# Altium schematic sheet MCU.SchDoc
size A3; SheetNumber: 2; SheetTotal: 9
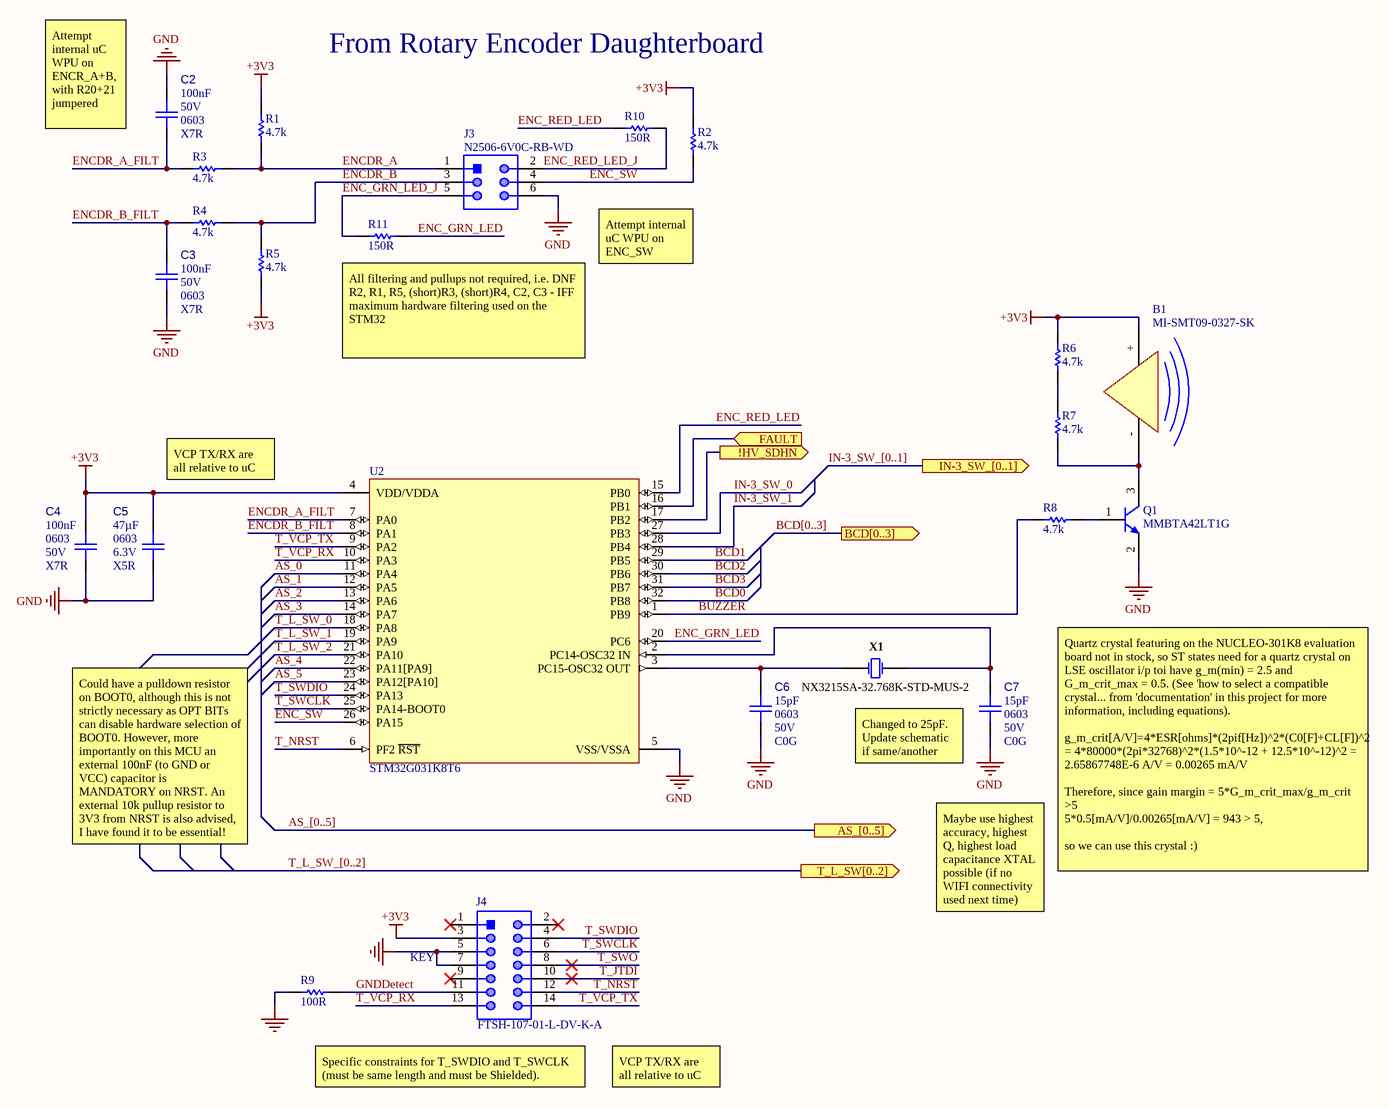
[diagram p0: MCU.SchDoc]

## Parts
?  (no value)
B1  MI-SMT09-0327-SK  [INDP9696X53N]
C2  value 100nF  Voltage Rating: 50V  Case/Package: 0603  Dielectric: X7R  [CAPC1608X09N]  (hidden comment: CGA3E2X7R1H104K080AA)
C3  value 100nF  Voltage Rating: 50V  Case/Package: 0603  Dielectric: X7R  [CAPC1608X09N]  (hidden comment: CGA3E2X7R1H104K080AA)
C4  value 100nF  Voltage Rating: 50V  Case/Package: 0603  Dielectric: X7R  [CAPC1608X09N]  (hidden comment: CGA3E2X7R1H104K080AA)
C5  value 47µF  Dielectric: X5R  Voltage Rating: 6.3V  Case/Package: 0603  [CAPC1608X87X35NL15T15]  (hidden comment: 06036D476MAT2A)
C6  value 15pF  Voltage Rating: 50V  Dielectric: C0G  Case/Package: 0603  [CAPC1608X87X35NL15T15]  (hidden comment: C0603X150J5GACTU)
C7  value 15pF  Voltage Rating: 50V  Dielectric: C0G  Case/Package: 0603  [CAPC1608X87X35NL15T15]  (hidden comment: C0603X150J5GACTU)
J3  N2506-6V0C-RB-WD  [N2506-6V0C-RB-WD-Footprint-1]
J4  FTSH-107-01-L-DV-K-A  [FP-FTSH-107-01-L-DV-K-A-MFG]
Q1  MMBTA42LT1G  [ONSC-SOT-23-3-318-08_V]
R1  value 4.7k  [RESC1608X55X25NL10T15]  (hidden comment: Resistor 4k7 +/-1% 0603 100 mW)
R2  value 4.7k  [RESC1608X55X25NL10T15]  (hidden comment: Resistor 4k7 +/-1% 0603 100 mW)
R3  value 4.7k  [RESC1608X55X25NL10T15]  (hidden comment: Resistor 4k7 +/-1% 0603 100 mW)
R4  value 4.7k  [RESC1608X55X25NL10T15]  (hidden comment: Resistor 4k7 +/-1% 0603 100 mW)
R5  value 4.7k  [RESC1608X55X25NL10T15]  (hidden comment: Resistor 4k7 +/-1% 0603 100 mW)
R6  value 4.7k  [RESC1608X55X25NL10T15]  (hidden comment: Resistor 4k7 +/-1% 0603 100 mW)
R7  value 4.7k  [RESC1608X55X25NL10T15]  (hidden comment: Resistor 4k7 +/-1% 0603 100 mW)
R8  value 4.7k  [RESC1608X55X25NL10T15]  (hidden comment: Resistor 4k7 +/-1% 0603 100 mW)
R9  value 100R  [RESC1608X55X25NL10T15]  (hidden comment: ERJ-3EKF1000V)
R10  value 150R  [RESC1608X55X25NL10T15]  (hidden comment: CRCW0603150RFKEAHP)
R11  value 150R  [RESC1608X55X25NL10T15]  (hidden comment: CRCW0603150RFKEAHP)
U2  STM32G031K8T6  [TQFP80P900X900X160-32N]
X1  NX3215SA-32.768K-STD-MUS-2  [NX3215SA-32.768K-STD-MUS-2-Footprint-1]

## Ports
!HV_SDHN (out), AS_[0..5] (out), BCD[0..3] (out), FAULT (in), IN-3_SW_[0..1] (out), T_L_SW[0..2] (out)

## Nets
+3V3: B1.+(VCC) C4.1 C5.1 J4.3 R1.2 R2.2 R5.1 R6.2 U2.4(VDD/VDDA)
GND: C2.2 C3.1 C4.2 C5.2 C6.2 C7.2 J3.6 J4.5 J4.7 Q1.2(E) R9.1 U2.5(VSS/VSSA)
!HV_SDHN: U2.17(PB2) ; port !HV_SDHN
AS_0: U2.11(PA4)
AS_1: U2.12(PA5)
AS_2: U2.13(PA6)
AS_3: U2.14(PA7)
AS_4: U2.22(PA11[PA9])
AS_5: U2.23(PA12[PA10])
BCD0: U2.32(PB8)
BCD1: U2.29(PB5)
BCD2: U2.30(PB6)
BCD3: U2.31(PB7)
BUZZER: R8.1 U2.1(PB9)
ENC_GRN_LED: R11.2 U2.20(PC6)
ENC_GRN_LED_J: J3.5 R11.1
ENC_RED_LED: R10.2 U2.15(PB0)
ENC_RED_LED_J: J3.2 R10.1
ENC_SW: J3.4 R2.1 U2.26(PA15)
ENCDR_A: J3.1 R1.1 R3.2
ENCDR_A_FILT: C2.1 R3.1 U2.7(PA0)
ENCDR_B: J3.3 R4.2 R5.2
ENCDR_B_FILT: C3.2 R4.1 U2.8(PA1)
FAULT: U2.16(PB1) ; port FAULT
GNDDetect: J4.11 R9.2
IN-3_SW_0: U2.27(PB3)
IN-3_SW_1: U2.28(PB4)
T_JTDI: J4.10
T_L_SW_0: U2.18(PA8)
T_L_SW_1: U2.19(PA9)
T_L_SW_2: U2.21(PA10)
T_NRST: J4.12 U2.6(PF2_~{RST})
T_SWCLK: J4.6 U2.25(PA14-BOOT0)
T_SWDIO: J4.4 U2.24(PA13)
T_SWO: J4.8
T_VCP_RX: J4.13 U2.10(PA3)
T_VCP_TX: J4.14 U2.9(PA2)
NetB1_-: B1.-(GND) Q1.3(C) R7.1
NetC6_1: C6.1 U2.3(PC15-OSC32_OUT) X1.1
NetC7_1: C7.1 U2.2(PC14-OSC32_IN) X1.2
NetQ1_1: Q1.1(B) R8.2
NetR6_1: R6.1 R7.2

Not connected (* = marked no-connect by the designer): J4 1* 2* 9*

## Buses and harness runs
bus AS_[0..5] = port AS_[0..5]
bus BCD[0..3] = port BCD[0..3]
bus IN-3_SW_[0..1] = port IN-3_SW_[0..1]
bus T_L_SW_[0..2] = port T_L_SW[0..2]

## Notes on the sheet
- From Rotary Encoder Daughterboard
- (near C2) Attempt internal uC WPU on ENCR_A+B, with R20+21 jumpered
- Attempt internal uC WPU on ENC_SW
- (near R11) All filtering and pullups not required, i.e. DNF R2, R1, R5, (short)R3, (short)R4, C2, C3 - IFF maximum hardware filtering used on the STM32
- VCP TX/RX are all relative to uC
- Changed to 25pF. Update schematic if same/another 12.5pF load capacitance XTAL is used
- Could have a pulldown resistor on BOOT0, although this is not strictly necessary as OPT BITs can disable hardware selection of BOOT0. However, more importantly on this MCU an external 100nF (to GND or VCC) capacitor is MANDATORY on NRST. An external 10k pullup resistor to 3V3 from NRST is also advised, I have found it to be essential!
- Maybe use highest accuracy, highest Q, highest load capacitance XTAL possible (if no WIFI connectivity used next time)
- Quartz crystal featuring on the NUCLEO-301K8 evaluation board not in stock, so ST states need for a quartz crystal on LSE oscillator i/p toi have g_m(min) = 2.5 and G_m_crit_max = 0.5. (See 'how to select a compatible crystal... from 'documentation' in this project for more information, including equations).
  g_m_crit[A/V]=4*ESR[ohms]*(2pif[Hz])^2*(C0[F]+CL[F])^2 = 4*80000*(2pi*32768)^2*(1.5*10^-12 + 12.5*10^-12)^2 = 2.65867748E-6 A/V = 0.00265 mA/V
  Therefore, since gain margin = 5*G_m_crit_max/g_m_crit >5
  5*0.5[mA/V]/0.00265[mA/V] = 943 > 5,
  so we can use this crystal :)
- (near J4) KEY
- Specific constraints for T_SWDIO and T_SWCLK (must be same length and must be Shielded).
- Project:
- Designer:
- Sheet
- of
- Filename:

## Library data of the parts
? = CMP-00003-4: The KETS Schematic Sheet Title Block
B1 = CMP-00030-00004-2: Magnetic Indicator SMT 9.6MM 3V; RoHS Compliant: Yes; Mounting Technology: SMT; Pins: 2
C2-C4 = CMP-001-00101-1: Ceramic Capacitor, Multilayer, Ceramic, 50V, 10% +Tol, 10% -Tol, X7R, 15% TC, 0.1uF, Surface Mount, 0603; Reference Standard: AEC-Q200; Multilayer: Yes; Tolerance  (fill in as +-): 10%; Mounting Technology: Surface Mount; Max Operating Temperature: 125°C; Min Operating Temperature: -55°C; Tolerance: 10%; Packaging: Tape and Reel; Length: 1.6mm; Package Style: SMTMeter; Width: 0.8mm; Height: 0.8mm; Pins: 2; Reach SVHC Compliant: Yes; RoHS Compliant: Yes; Package Shape: Rectangular; Tolerance (fill in as +-): 10%; Rated DC Voltage (URdc): 50V; JESD-609 Code: e3; Capacitor Type: Ceramic; Termination: Wraparound; Terminal Finish: Nickel; Dielectric Material: Ceramic; Temperature Characteristics Code: X7R
C5 = CMP-00388-1: 0603 (1608Metric) CERAMIC CAPACITOR ceramic capacitor 6.3V 47uF ±20% X5R; Capacitor Type: MLCC; Number of Terminals: 2; Mounting Technology: Surface Mount; Length: 1.6mm; Tolerance: 20%; Max Operating Temperature: 85°C; Lifecycle Status: Production; Min Operating Temperature: -55°C; Schedule B: 8532240020; Voltage Rating (DC): 6.3V; RoHS Compliant: Yes; Pins: 2; RoHS: Compliant; Height: 1.02mm; Dielectric Material: Ceramic; Width: 800µm; Material: Ceramic; REACH SVHC: Yes
C6 C7 = CMP-00385-1: Cap Ceramic 15pF 50V C0G 5% Pad SMD 0603 Flexible Termination 125C Extreme Low ESR T/R; RoHS Compliant: Yes; Termination: SMD/SMT; Case Code (Imperial): 0603; Features: Soft Termination; Schedule B: 8532240020, 8532240020; Tolerance: 5%; Voltage Rating (DC): 50V; Lifecycle Status: Production; Depth: 800µm; Length: 1.6mm; Height: 800µm; Packaging: Tape & Reel; Case Code (Metric): 1608; China RoHS: Compliant; Thickness: 863.6µm; Pins: 2; Max Operating Temperature: 125°C; Mounting Technology: Surface Mount; Lead Free: Lead Free; Dielectric Material: Ceramic; RoHS: Compliant; Min Operating Temperature: -55°C; Radiation Hardening: No; Number of Terminals: 2; Width: 800µm; REACH SVHC: Yes
J3 = CMP-002-00208-1: 80001386988 N2506-6V0C-Rb-Wd=06//Ht/Vsmt/30U/Rohs/Cap/T&r; Number of Positions: 6; Current Rating: 5A; Pitch: 2.54mm; Connector Type: Male Pin; Insulation Resistance: 1GΩ; Plating Thickness: 762nm; Row Spacing: 6.86mm; Color: Black; Pins: 6; Max Operating Temperature: 105°C; Terminal Pitch: 2.54mm; Number of Rows: 2; Contact Plating: Gold; Mounting Technology: Surface Mount; Min Operating Temperature: -55°C; REACH SVHC: Yes; Contact Mating Length: 6.1722mm; Height: 11.06mm; Contact Gender: Male; Termination: Solder; Contact Material: Gold, Tin; Lifecycle Status: Production; RoHS: Compliant; Number of Contacts: 6
J4 = CMP-002-00203-1: Conn Unshrouded Header HDR 14 POS 1.27mm Solder ST Top Entry SMD TIGER CLAW™ Tube; Manufacturer Lifecycle Status: PRODUCTION; Current Rating: 3.4A; Gender: Male; Number of Contacts: 14; Contact Plating: Gold; Pitch: 1.27mm; Termination: Solder; Orientation: Vertical; Lifecycle Status: Production; Number of Rows: 2; Max Operating Temperature: 125°C; Pins: 14; Height: 6.38mm; Schedule B: 8536694040; Contact Material: Gold, Nickel; Lead Free: Lead Free; Min Operating Temperature: -55°C; RoHS: Compliant
Q1 = CMP-013-00062-1: Bipolar (BJT) Single Transistor, General Purpose, NPN, 300 V, 500 mA, 225 mW, SOT-23, Surface Mount; Manufacturer Lifecycle Status: ACTIVE; Frequency: 50MHz; Max Collector Current: 500mA; Collector Emitter Breakdown Voltage: 300V; Emitter Base Voltage (VEBO): 6V; Collector Emitter Saturation Voltage: 500mV; Number of Elements: 1; Max Power Dissipation: 300mW; hFE Min: 40; Clock Frequency: 50MHz; Element Configuration: Single; Packaging: Tape and Reel; Lead Free: Lead Free; RoHS: Compliant; Number of Terminals: 3; Lifecycle Status: Production; Current Rating: 500mA; Polarity: NPN; Width: 1.397mm; Case/Package: SOT-23-3; Max Operating Temperature: 150°C; China RoHS: Compliant; Height: 1.016mm; Weight: 4.535924g; Gain Bandwidth Product: 50MHz; Contact Plating: Tin; Schedule B: 8541210080, 8541210080; Pins: 3; Transition Frequency: 50MHz; Voltage Rating (DC): 300V; REACH SVHC: Yes; Collector Emitter Voltage (VCEO): 300V; Min Operating Temperature: -55°C; Collector Base Voltage (VCBO): 300V; Length: 3.0226mm; Max Breakdown Voltage: 300V; Radiation Hardening: No
R1-R8 = CMP-009-00031-13: Chip Resistor, 4.7 KOhm, +/- 1%, 0.1 W, -55 to 155 degC, 0603 (1608 Metric); Power: 100mW; RoHS Compliant: True; Min Operating Temperature: -55°C; Tolerance: 1%; Mounting Technology: SM; Max Operating Temperature: 155°C; Pins: 2; Case/Package: 0603
R9 = CMP-00265-1: Fixed Resistor, Metal Glaze/thick Film, 0.1W, 100ohm, 75V, 1% +/-Tol, 100ppm/Cel, Surface Mount, 0603; Package Length: 1.6mm; Package Height: 0.45mm; Power: 100mW; Temperature Coefficient (ppm/Cel): 100; Package Width: 0.8mm; Reference Standard: AEC-Q200; Rated Temperature: 70°C; Mounting Technology: Surface Mount; Pins: 2; Packaging: Tape and Reel; Case/Package: 0603; Technology: METAL GLAZE/THICK FILM; Voltage Rating: 75V; RoHS Compliant: Yes; Construction: Rectangular; Max Operating Temperature: 155°C; JESD-609 Code: e3; Tolerance: 1%; Reach SVHC Compliant: Yes; Package Shape: Rectangular; Resistor Type: FIXED RESISTOR; Terminal Finish: Nickel; Termination: Wraparound; Working Voltage: 75V; Min Operating Temperature: -55°C
R10 R11 = CMP-00382-2: Res Thick Film 0603 150 Ohm 1% 1/3W ±100ppm/°C Molded SMD SMD Paper T/R; Voltage Rating: 75V; Power Rating: 330mW; Max Power Dissipation: 250mW; Power: 100mW; Case Code (Metric): 1608; Pins: 2; Lifecycle Status: Production; Radiation Hardening: No; Tolerance: 1%; Packaging: Cut Tape; RoHS: Compliant; Features: Automotive AEC-Q200; Case/Package: 0603; Number of Terminations: 2; Lead Free: Lead Free; RoHS Compliant: Yes; Depth: 850µm; Height: 450µm; Min Operating Temperature: -55°C; Max Operating Temperature: 155°C; Length: 1.55mm; China RoHS: Non-Compliant; Temperature Coefficient: 100ppm/°C; Schedule B: 8533210045, 8533210045; Composition: Thick Film; Working Voltage: 75V; Weight: 2.012816mg; Military Standard: Not; Mounting Technology: Surface Mount; Voltage Rating (DC): 75V; Number of Terminals: 2; Termination: SMD/SMT; Case Code (Imperial): 0603; Contact Plating: Tin; Width: 850µm; Power Dissipation: 330mW; REACH SVHC: Yes
U2 = CMP-00383-2: RISC Microcontroller, 32-Bit, FLASH, CORTEX-M0 CPU, 64MHz, CMOS, PQFP32; Supply Voltage Max: 3.6V; Min Supply Voltage: 1.7V; Flash Memory Size: 64kB; EEPROM Memory Size: 0B; Number of A/D Converters: 1; Clock Frequency: 48MHz; Number of USART Channels: 2; Data Memory: 8K; Program Memory: 64K; Peripherals: POR; RAM Size: 8kB; Number of I/Os: 3; Operating Supply Voltage: 1.8V; ADC Channels (Resolution): 16-Ch 12-Bit; Number of Timers/Counters: 9; Number of PWM Channels: 17; Max Junction Temperature (Tj): 105°C; Data Bus Width: 32b; Register Bit Depth: 32; Max Supply Current: 6.9mA; Core Architecture: ARM Cortex-M0+; Interface: I2C, I2S, IrDA, LIN, SMBus, SPI, UART, USART; Number of ADC Channels: 16; Terminal Pitch: 800µm; Length: 7mm; REACH SVHC: Yes; China RoHS: Compliant; Number of SPI Channels: 2; Height - Seated (Max): 1.6mm; Number of Terminals: 32; Width: 7mm; Number of UART Channels: 3; Number of I2C Channels: 2; Maximum Clock Frequency: 64MHz; Ambient Temperature Range High: 85°C; Frequency: 64MHz; Height: 1.6mm; Pins: 32; Supply Voltage Min: 1.7V; Memory Format: FLASH; Lifecycle Status: Production; Max Supply Voltage: 3.6V; Memory Size: 64kB; Schedule B: 8542310000; Min Operating Temperature: -40°C; Max Operating Temperature: 85°C; RoHS: Compliant
X1 = CMP-003-00032-2: Crystal 0.032768MHz ±20ppm (Tol) 12.5pF FUND 80000Ohm Automotive AEC-Q200 2-Pin SMD; ESR (Equivalent Series Resistance): 80kΩ; ESR: 80k; Frequency Tolerance: 0.002%; Frequency: 32.768kHz; Frequency Stability: 400ppm; Min Operating Temperature: -40°C; Lifecycle Status: Production; Schedule B: 8541600080; RoHS: Compliant; Width: 1.4986mm; REACH SVHC: Yes; Length: 3.2004mm; Mounting Technology: Surface Mount; Max Operating Temperature: 125°C; Tolerance: 0.002%; Case/Package: SMD/SMT; Pins: 2; Load Capacitance: 12.5pF; Packaging: Tape & Reel (TR); RoHS Compliant: Yes; Height: 900µm